# Altium schematic sheet interface_ntc10k.SchDoc
size A; SheetNumber: 19
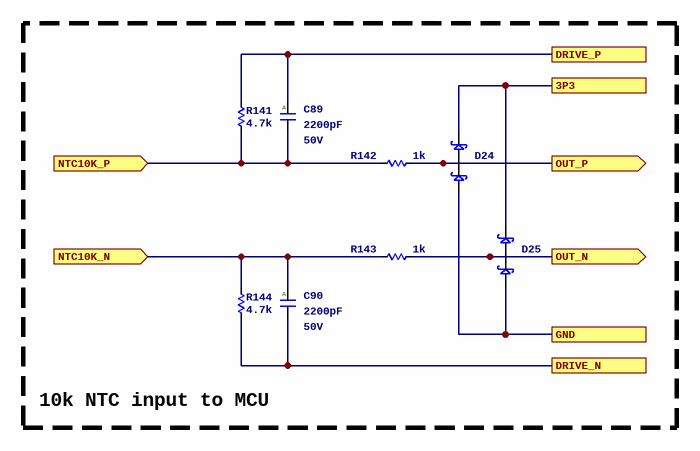
[diagram p0: interface_ntc10k.SchDoc]

## Parts
C89  Capacitance: 2200pF  Voltage - Rated: 50V  [C0402_0.55MM]  (hidden comment: CGA2B2X7R1H222M050BA)
C90  Capacitance: 2200pF  Voltage - Rated: 50V  [C0402_0.55MM]  (hidden comment: CGA2B2X7R1H222M050BA)
D24  BAT54SLT1G  [3SOT23]  (value not drawn)
D25  BAT54SLT1G  [3SOT23]  (value not drawn)
R141  Resistance: 4.7k  [R0402_0.40MM]  (hidden comment: ERJ-2RKF4701X)
R142  Resistance: 1k  [R0402_0.40MM]
R143  Resistance: 1k  [R0402_0.40MM]
R144  Resistance: 4.7k  [R0402_0.40MM]  (hidden comment: ERJ-2RKF4701X)

## Blocks framed on the sheet
10k NTC input to MCU: C89 C90 D24 D25 R141-R144

## Ports
3P3, DRIVE_N, DRIVE_P, GND, NTC10K_N (in), NTC10K_P (in), OUT_N (out), OUT_P (out)

## Nets
3P3: D24.2 D25.2 ; port 3P3
DRIVE_N: C90.2 R144.2 ; port DRIVE_N
DRIVE_P: C89.1 R141.1 ; port DRIVE_P
GND: D24.1 D25.1 ; port GND
NTC10K_N: C90.1 R143.1 R144.1 ; port NTC10K_N
NTC10K_P: C89.2 R141.2 R142.1 ; port NTC10K_P
OUT_N: D25.3 R143.2 ; port OUT_N
OUT_P: D24.3 R142.2 ; port OUT_P

## Notes on the sheet
- (in symbol CGA2B2X7R1H222M050BA) A

## Library data of the parts
C89 C90 = CGA2B2X7R1H222M050BA: CAP CER 2200PF 50V X7R 0402; Manufacturer: TDK Corporation; Unit Price (USD): 0.1; Tolerance: ±20%; ComponentLink1URL: https://product.tdk.com/info/en/catalog/datasheets/mlcc_automotive_general_en.pdf?ref_disty=digikey; ComponentLink1Description: Series Datasheet; Series: CGA; Part Status: Active; Temperature Coefficient: X7R; Operating Temperature: -55°C ~ 125°C; Applications: AEC-Q200; Mounting Type: Surface Mount, MLCC; Package / Case: 0402 (1005 Metric); Size / Dimension: 0.039" L x 0.020" W (1.00mm x 0.50mm); Thickness (Max): 0.022" (0.55mm); Supplier 1: Digikey; Supplier Part Number 1: 445-12274-1-ND; Manufacturer Part Number: CGA2B2X7R1H222M050BA
D24 D25 = SCHOTTKY_30V_DUAL_BAT54SLT1G: DIODE SCHOTTKY DUAL 30V SOT23; Manufacturer: ON Semiconductor; Supplier 1: Digikey; Manufacturer Part Number: BAT54SLT1G; RoHS: RoHS Compliant; ComponentLink1URL: https://www.onsemi.com/pdf/datasheet/bat54slt1-d.pdf; ComponentLink1Description: Datasheet; Supplier Part Number 1: BAT54SLT1GOSCT-ND; Supplier 2: LCSC; Supplier Part Number 2: C19726
R141 R144 = ERJ-2RKF4701X: RES SMD 4.7K OHM 1% 1/10W 0402; Manufacturer: Panasonic Electronic Components; Unit Price (USD): 0.1; Power (Watts): 0.1W, 1/10W; Temperature Coefficient: ±100ppm/°C; ComponentLink1Description: Datasheet; ComponentLink1URL: https://industrial.panasonic.com/cdbs/www-data/pdf/RDA0000/AOA0000C304.pdf; Series: ERJ; Tolerance: ±1%; Composition: Thick Film; Features: Automotive AEC-Q200; Operating Temperature: -55°C ~ 155°C; Package / Case: 0402 (1005 Metric); Supplier Device Package: 0402; Size / Dimension: 0.039" L x 0.020" W (1.00mm x 0.50mm); Height - Seated (Max): 0.016" (0.40mm); Supplier 1: Digikey; Supplier Part Number 1: P4.70KLCT-ND; Manufacturer Part Number: ERJ-2RKF4701X
R142 R143 = ERJ-2RKF1001X: RES SMD 1K OHM 1% 1/10W 0402; Manufacturer 1: Panasonic Electronic Components; Unit Price (USD): 0.1; Power (Watts): 0.1W, 1/10W; Temperature Coefficient: ±100ppm/°C; ComponentLink1Description: Datasheet; ComponentLink1URL: https://industrial.panasonic.com/cdbs/www-data/pdf/RDA0000/AOA0000C304.pdf; Series: ERJ; Tolerance: ±1%; Composition: Thick Film; Features: Automotive AEC-Q200; Operating Temperature: -55°C ~ 155°C; Package / Case: 0402 (1005 Metric); Supplier Device Package: 0402; Size / Dimension: 0.039" L x 0.020" W (1.00mm x 0.50mm); Height - Seated (Max): 0.016" (0.40mm); Manufacturer Part Number 1: ERJ-2RKF1001X; Supplier 1: Digikey; Supplier Part Number 1: P1.00KLCT-ND